# EAGLE design Brushless Slave2 (EAGLE 9.5.2)
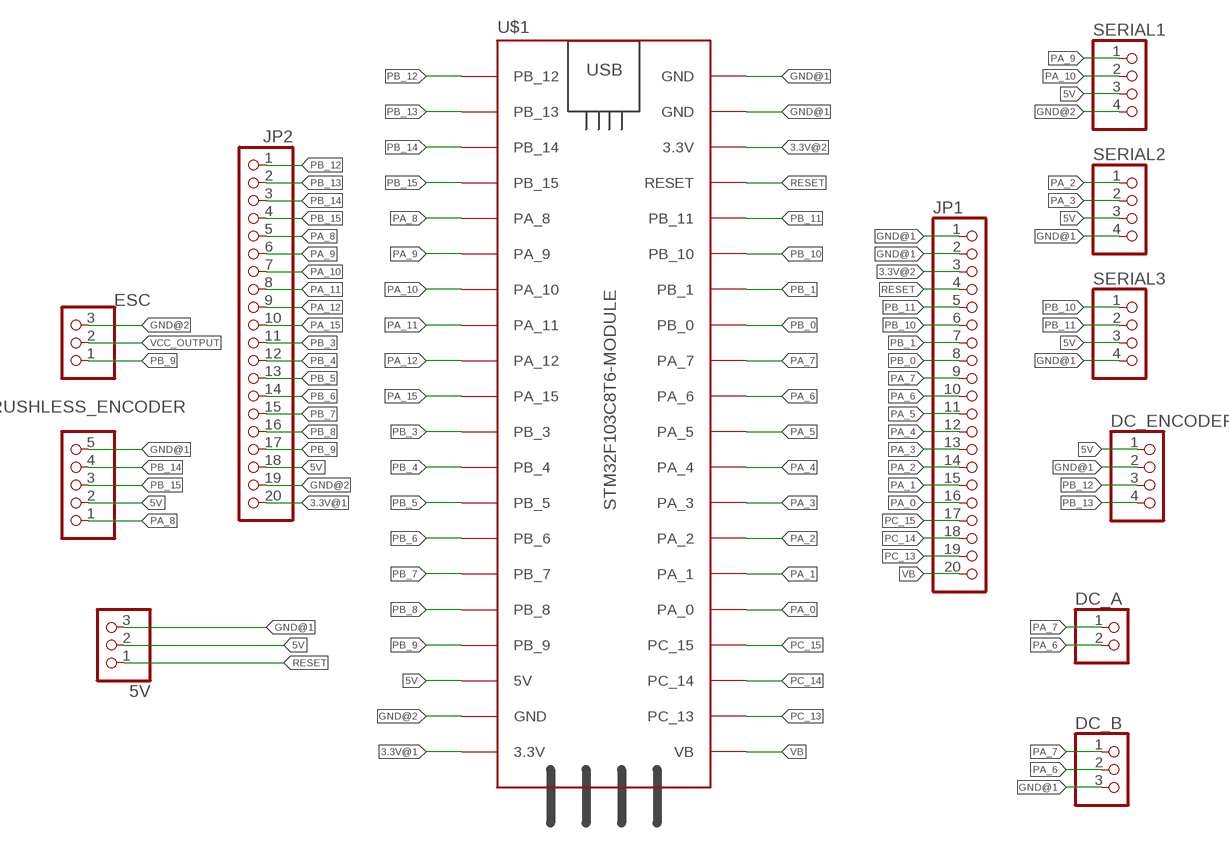
[diagram p0: schematic, sheet 1]

## Parts
5V  PINHD-3_DATA  [1X03_DATA]
BRUSHLESS_ENCODER  PINHD-5_DATA  [1X05_DATA]
DC_A  PINHD-2_DATA  [1X02_DATA]
DC_B  PINHD-3_DATA  [1X03_DATA]
DC_ENCODER  PINHD-4_DATA  [1X04_DATA]
ESC  PINHD-3_DATA  [1X03_DATA]
JP1  PINHD-1X20  [1X20]
JP2  PINHD-1X20  [1X20]
SERIAL1  PINHD-4_DATA  [1X04_DATA]
SERIAL2  PINHD-4_DATA  [1X04_DATA]
SERIAL3  PINHD-4_DATA  [1X04_DATA]
U$1  STM32F103C8T6-MODULE  [STM32F103C8T6-MODULE]

## Nets
3.3V@1: JP2.20 U$1.3.3V_1(3.3V)
3.3V@2: JP1.3 U$1.3.3V_2(3.3V)
5V: 5V.2 BRUSHLESS_ENCODER.2 DC_ENCODER.1 JP2.18 SERIAL1.3 SERIAL2.3 SERIAL3.3 U$1.5V
GND@1: 5V.3 BRUSHLESS_ENCODER.5 DC_B.3 DC_ENCODER.2 JP1.1 JP1.2 SERIAL2.4 SERIAL3.4 U$1.GND_2(GND) U$1.GND_3(GND)
GND@2: ESC.3 JP2.19 SERIAL1.4 U$1.GND_1(GND)
PA_0: JP1.16 U$1.PA_0
PA_1: JP1.15 U$1.PA_1
PA_2: JP1.14 SERIAL2.1 U$1.PA_2
PA_3: JP1.13 SERIAL2.2 U$1.PA_3
PA_4: JP1.12 U$1.PA_4
PA_5: JP1.11 U$1.PA_5
PA_6: DC_A.2 DC_B.2 JP1.10 U$1.PA_6
PA_7: DC_A.1 DC_B.1 JP1.9 U$1.PA_7
PA_8: BRUSHLESS_ENCODER.1 JP2.5 U$1.PA_8
PA_9: JP2.6 SERIAL1.1 U$1.PA_9
PA_10: JP2.7 SERIAL1.2 U$1.PA_10
PA_11: JP2.8 U$1.PA_11
PA_12: JP2.9 U$1.PA_12
PA_15: JP2.10 U$1.PA_15
PB_0: JP1.8 U$1.PB_0
PB_1: JP1.7 U$1.PB_1
PB_3: JP2.11 U$1.PB_3
PB_4: JP2.12 U$1.PB_4
PB_5: JP2.13 U$1.PB_5
PB_6: JP2.14 U$1.PB_6
PB_7: JP2.15 U$1.PB_7
PB_8: JP2.16 U$1.PB_8
PB_9: ESC.1 JP2.17 U$1.PB_9
PB_10: JP1.6 SERIAL3.1 U$1.PB_10
PB_11: JP1.5 SERIAL3.2 U$1.PB_11
PB_12: DC_ENCODER.3 JP2.1 U$1.PB_12
PB_13: DC_ENCODER.4 JP2.2 U$1.PB_13
PB_14: BRUSHLESS_ENCODER.4 JP2.3 U$1.PB_14
PB_15: BRUSHLESS_ENCODER.3 JP2.4 U$1.PB_15
PC_13: JP1.19 U$1.PC_13
PC_14: JP1.18 U$1.PC_14
PC_15: JP1.17 U$1.PC_15
RESET: 5V.1 JP1.4 U$1.RESET
VB: JP1.20 U$1.VB
VCC_OUTPUT: ESC.2

## Library data of the parts
5V DC_B ESC = MIA_LIBRARY-2-2-2:PINHD-3_DATA: PIN HEADER
BRUSHLESS_ENCODER = MIA_LIBRARY-2-2-2:PINHD-5_DATA: PIN HEADER
DC_A = MIA_LIBRARY-2-2-2:PINHD-2_DATA: PIN HEADER
DC_ENCODER SERIAL1-SERIAL3 = MIA_LIBRARY-2-2-2:PINHD-4_DATA: PIN HEADER
JP1 JP2 = MIA_LIBRARY-2-2-2:PINHD-1X20: PIN HEADER
U$1 = MIA_LIBRARY-2-2-2:STM32F103C8T6-MODULE: STM32F103C8T6 module with ARM Cortex-3, 20kB SRAM, 64kB Flash, 72MHz

## Board
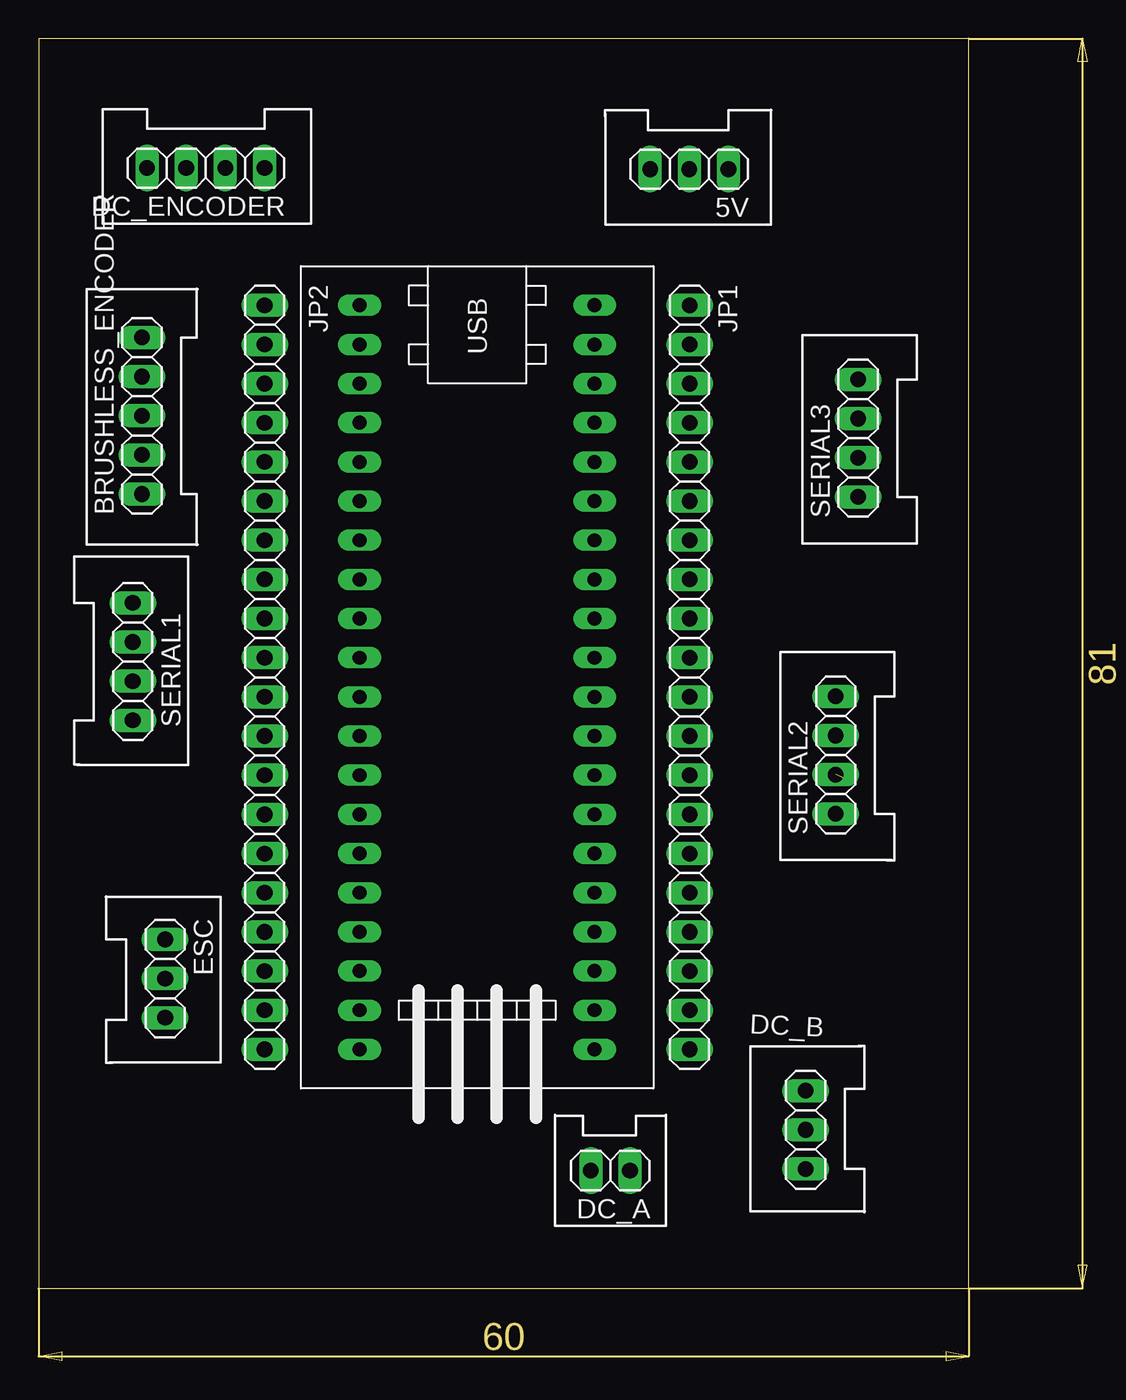
[diagram p1: board, top side]
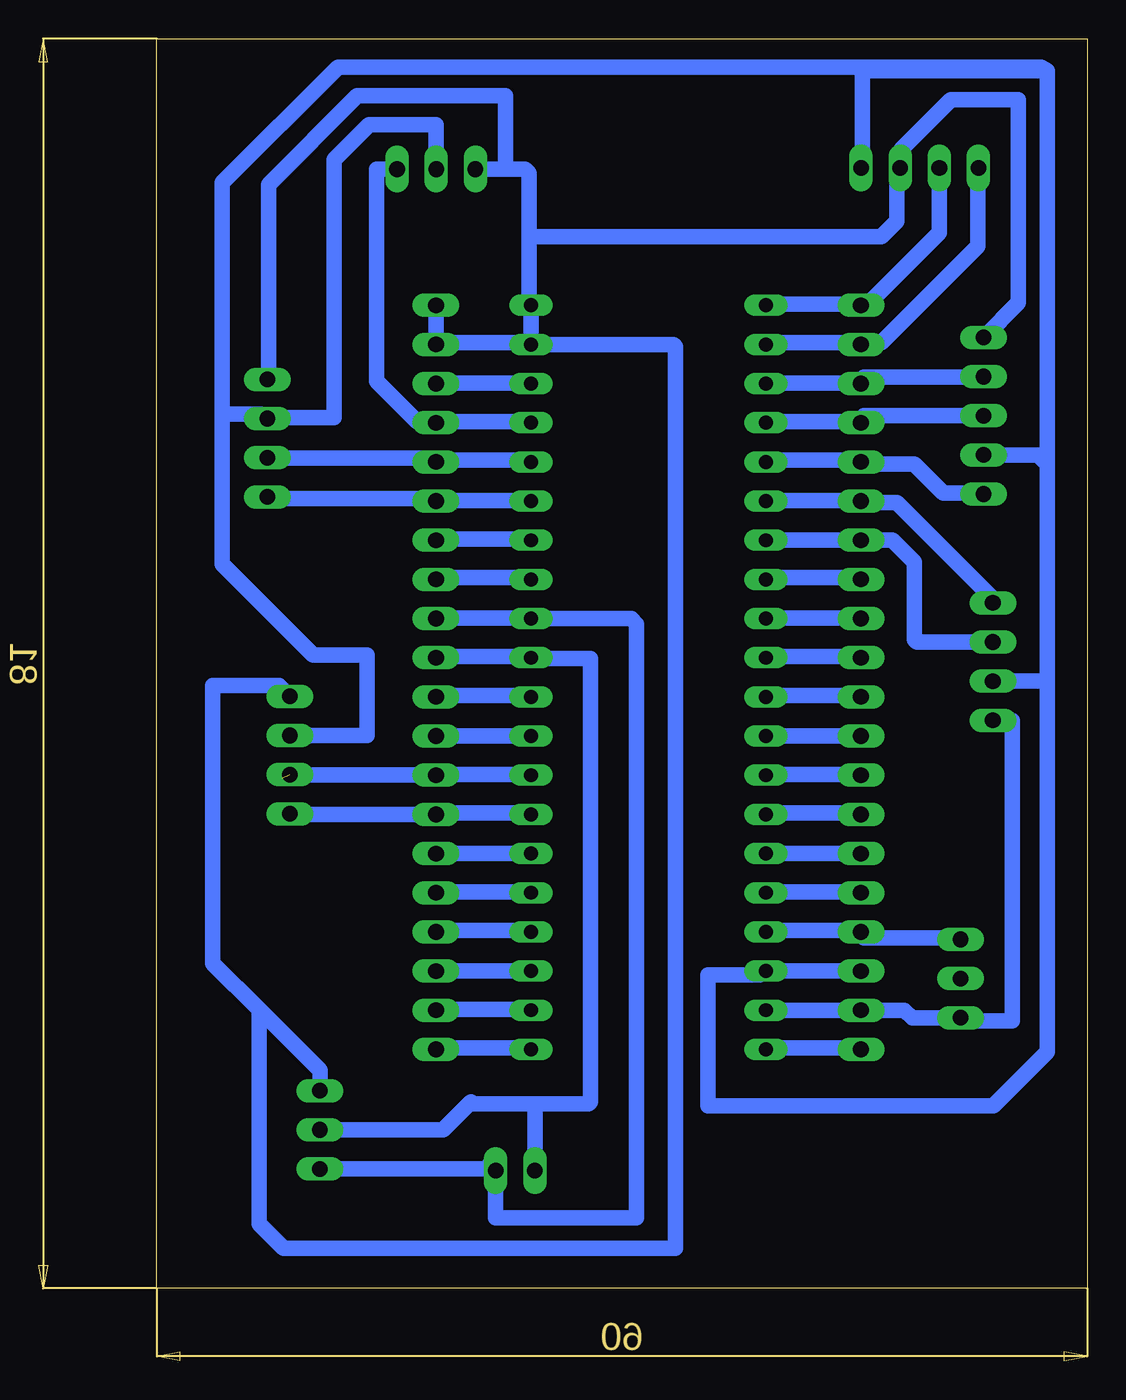
[diagram p2: board, bottom side, seen from below]

Size 60.34 x 81.07 mm. Coordinates in mm from the lower left corner, seen from the top.
Outline: 0,0 60.34,0 60.34,81.07 0,81.07 0,0
Copper layers (1*16): Top 0.035mm / dielectric 0.15mm / Bottom 0.035mm
Design rules "default *": minimum track width 1mm, minimum drill 0.35mm, track to track 0.8mm, track to pad 0.8mm, pad to pad 0.8mm, via to via 0.8mm, smd to smd 6mil, copper to edge 0.8mm, drill to drill 6mil, minimum pad ring 10mil, minimum via ring 8mil, stop-mask expansion 4mil, vias tented up to drill 0mil, thermal gap 10mil

### Footprints (pad centres in the part's own frame; a part is rotated, then mirrored left to right if it is on the bottom)
1X03_DATA = drill 1.016 long: 1 -2.54,0; 2 0,0; 3 2.54,0
1X05_DATA = drill 1.016 long: 1 -5.08,0; 2 -2.54,0; 3 0,0; 4 2.54,0; 5 5.08,0
1X02_DATA = drill 1.016 long: 1 -1.27,0; 2 1.27,0
1X04_DATA = drill 1.016 long: 1 -3.81,0; 2 -1.27,0; 3 1.27,0; 4 3.81,0
1X20 = drill 1.016 long: 1 -24.13,0; 2 -21.59,0; 3 -19.05,0; 4 -16.51,0; 5 -13.97,0; 6 -11.43,0; 7 -8.89,0; 8 -6.35,0; 9 -3.81,0; 10 -1.27,0; 11 1.27,0; 12 3.81,0; 13 6.35,0; 14 8.89,0; 15 11.43,0; 16 13.97,0; 17 16.51,0; 18 19.05,0; 19 21.59,0; 20 24.13,0
STM32F103C8T6-MODULE = drill 0.9 long: 3.3V_1 25.4,-7.62; 3.3V_2 -17.78,7.62; 5V 20.32,-7.62; GND_1 22.86,-7.62; GND_2 -20.32,7.62; GND_3 -22.86,7.62; PA_0 15.24,7.62; PA_1 12.7,7.62; PA_2 10.16,7.62; PA_3 7.62,7.62; PA_4 5.08,7.62; PA_5 2.54,7.62; PA_6 0,7.62; PA_7 -2.54,7.62; PA_8 -12.7,-7.62; PA_9 -10.16,-7.62; PA_10 -7.62,-7.62; PA_11 -5.08,-7.62; PA_12 -2.54,-7.62; PA_15 0,-7.62; PB_0 -5.08,7.62; PB_1 -7.62,7.62; PB_3 2.54,-7.62; PB_4 5.08,-7.62; PB_5 7.62,-7.62; PB_6 10.16,-7.62; PB_7 12.7,-7.62; PB_8 15.24,-7.62; PB_9 17.78,-7.62; PB_10 -10.16,7.62; PB_11 -12.7,7.62; PB_12 -22.86,-7.62; PB_13 -20.32,-7.62; PB_14 -17.78,-7.62; PB_15 -15.24,-7.62; PC_13 22.86,7.62; PC_14 20.32,7.62; PC_15 17.78,7.62; RESET -15.24,7.62; VB 25.4,7.62

### Placement (x,y rotation side)
5V  42.21,72.6 180 top
BRUSHLESS_ENCODER  6.71,56.6 90 top
DC_A  37.09,7.65 180 top
DC_B  49.76,10.29 90 top
DC_ENCODER  10.85,72.67 180 top
ESC  8.21,20.1 270 top
JP1  42.23,39.64 270 top
JP2  14.67,39.64 270 top
SERIAL1  6.11,40.66 270 top
SERIAL2  51.71,34.6 90 top
SERIAL3  53.16,55.15 90 top
U$1  28.45,40.91 270 top

### Tracks (layer width: path | path; a pad name or v marks a point on that pad's centre or on a via)
3.3V@1
  Bottom 1: U$1.3.3V_1 20.71,15.6 14.71,15.6 JP2.20
3.3V@2
  Bottom 1: U$1.3.3V_2 36.09,58.73 42.21,58.73 JP1.3
5V
  Bottom 1: 5V.2 42.21,75.47 46.59,75.47 48.84,73.22 48.84,56.48 53.09,56.48 SERIAL3.3 53.59,56.73 56.09,56.73 | JP2.18 14.71,20.6 20.71,20.6 U$1.5V 21.21,20.35 24.59,20.35 24.59,11.85 6.09,11.85 2.59,15.35 2.59,39.6 | 2.59,78.97 14.59,78.97 14.59,72.72 DC_ENCODER.1 | 2.59,53.48 2.59,78.97 | 56.09,56.73 56.09,71.72 48.59,79.22 2.96,79.22 2.59,78.97 | 56.09,56.73 56.09,46.98 50.21,41.1 46.71,41.1 46.71,35.87 SERIAL2.3 | BRUSHLESS_ENCODER.2 3.17,54.06 2.59,53.48 | 2.59,53.48 2.59,39.6 | 2.59,39.6 2.8,39.39 SERIAL1.3
GND@1
  Bottom 1: BRUSHLESS_ENCODER.5 4.46,63.93 4.46,77.1 8.84,77.1 12.09,73.85 12.09,72.72 DC_ENCODER.2 12.34,72.22 12.34,69.22 13.34,68.22 36.21,68.22 | JP1.1 42.21,63.73 42.21,61.35 JP1.2 41.71,61.35 36.59,61.35 U$1.GND_2 | 36.21,68.22 36.21,72.35 36.46,72.6 5V.3 37.71,72.6 37.71,77.35 47.34,77.35 53.09,71.6 53.09,58.98 SERIAL3.4 | U$1.GND_2 26.84,61.23 26.71,61.1 26.71,2.6 52.13,2.6 53.71,4.18 53.71,18.1 | 36.21,68.22 36.21,63.91 U$1.GND_3 U$1.GND_2 | SERIAL2.4 52.4,39.1 56.71,39.1 56.71,21.1 53.71,18.1 | DC_B.3 49.76,14.15 53.71,18.1
GND@2
  Bottom 1: SERIAL1.4 4.84,36.85 4.84,17.35 8,17.35 ESC.3 8.23,17.54 11.33,17.54 11.84,18.05 JP2.19 U$1.GND_1
PA_0
  Bottom 1: U$1.PA_0 36.09,25.73 42.21,25.73 JP1.16
PA_1
  Bottom 1: U$1.PA_1 36.09,28.23 42.21,28.23 JP1.15
PA_2
  Bottom 1: U$1.PA_2 36.09,30.85 42.21,30.85 JP1.14 | JP1.14 43.37,30.75 | JP1.14 51.67,30.75 SERIAL2.1
PA_3  (1 unrouted)
  Bottom 1: U$1.PA_3 36.09,33.35 42.21,33.35 JP1.13 52.02,33.29 52.21,33.1
PA_4
  Bottom 1: U$1.PA_4 36.09,35.85 42.21,35.85 JP1.12
PA_5
  Bottom 1: U$1.PA_5 36.09,38.48 42.21,38.48 JP1.11
PA_6
  Bottom 1: JP1.10 42.21,40.98 36.09,40.98 U$1.PA_6 36.03,40.87 32.21,40.87 32.21,12.1 32.34,11.98 35.71,11.98 | 35.71,11.98 39.84,11.98 39.96,12.1 41.77,10.29 DC_B.2 | DC_A.2 35.82,11.87 35.71,11.98
PA_7
  Bottom 1: JP1.9 42.21,43.48 36.09,43.48 U$1.PA_7 29.56,43.45 29.21,43.1 29.21,4.6 38.36,4.6 DC_A.1 | 38.76,8.05 DC_A.1 | DC_B.1 38.46,7.75 DC_A.1
PA_8
  Bottom 1: U$1.PA_8 20.71,53.73 14.71,53.73 JP2.5 14.21,53.48 11.21,53.48 9.34,51.6 6.71,51.6 BRUSHLESS_ENCODER.1
PA_9
  Bottom 1: U$1.PA_9 20.71,51.1 14.71,51.1 JP2.6 14.21,50.98 12.34,50.98 6.11,44.75 SERIAL1.1
PA_10
  Bottom 1: SERIAL1.2 11.04,41.93 11.21,42.1 11.21,47.1 12.64,48.53 JP2.7 U$1.PA_10
PA_11
  Bottom 1: U$1.PA_11 20.71,46.1 14.71,46.1 JP2.8
PA_12
  Bottom 1: U$1.PA_12 20.71,43.48 14.71,43.48 JP2.9
PA_15
  Bottom 1: U$1.PA_15 20.71,40.98 14.71,40.98 JP2.10
PB_0
  Bottom 1: U$1.PB_0 36.09,46.1 42.21,46.1 JP1.8
PB_1
  Bottom 1: U$1.PB_1 36.09,48.6 42.21,48.6 JP1.7
PB_3
  Bottom 1: U$1.PB_3 20.71,38.48 14.71,38.48 JP2.11
PB_4
  Bottom 1: U$1.PB_4 20.71,35.85 14.71,35.85 JP2.12
PB_5
  Bottom 1: U$1.PB_5 20.71,33.35 14.71,33.35 JP2.13
PB_6
  Bottom 1: U$1.PB_6 20.71,30.85 14.71,30.85 JP2.14
PB_7
  Bottom 1: U$1.PB_7 20.71,28.23 14.71,28.23 JP2.15
PB_8
  Bottom 1: U$1.PB_8 20.71,25.73 14.71,25.73 JP2.16
PB_9
  Bottom 1: U$1.PB_9 20.71,23.23 14.71,23.23 JP2.17 14.46,22.73 8.21,22.73 ESC.1
PB_10
  Bottom 1: U$1.PB_10 36.09,51.1 42.21,51.1 JP1.6 42.71,51.23 53.09,51.23 SERIAL3.1
PB_11
  Bottom 1: U$1.PB_11 36.09,53.73 42.21,53.73 JP1.5 42.59,53.85 53.09,53.85 SERIAL3.2
PB_12
  Bottom 1: U$1.PB_12 20.71,63.85 14.71,63.85 JP2.1 14.29,63.77 9.59,68.47 9.59,72.6 DC_ENCODER.3
PB_13
  Bottom 1: U$1.PB_13 20.71,61.35 14.71,61.35 JP2.2 14.21,61.35 13.34,61.35 7.09,67.6 7.09,72.6 DC_ENCODER.4
PB_14
  Bottom 1: U$1.PB_14 20.71,58.73 14.71,58.73 JP2.3 14.46,59.1 6.71,59.1 BRUSHLESS_ENCODER.4
PB_15
  Bottom 1: U$1.PB_15 20.71,56.23 14.71,56.23 JP2.4 14.46,56.6 BRUSHLESS_ENCODER.3
PC_13
  Bottom 1: U$1.PC_13 36.09,18.1 42.21,18.1 JP1.19
PC_14
  Bottom 1: U$1.PC_14 36.09,20.6 42.21,20.6 JP1.18
PC_15
  Bottom 1: U$1.PC_15 36.09,23.23 42.21,23.23 JP1.17
RESET
  Bottom 1: U$1.RESET 36.09,56.23 42.21,56.23 JP1.4 42.71,56.23 43.46,56.23 46.09,58.85 46.09,72.6 5V.1
VB
  Bottom 1: U$1.VB 36.09,15.6 42.21,15.6 JP1.20